# EAGLE design microbutton (EAGLE 7.5.0)
PRODUCT_COMPANY: skagmo.com, 2015; PRODUCT_TITLE: HAPCAN compatible DALI gateway, rev. A

## Sheet 1 of 2
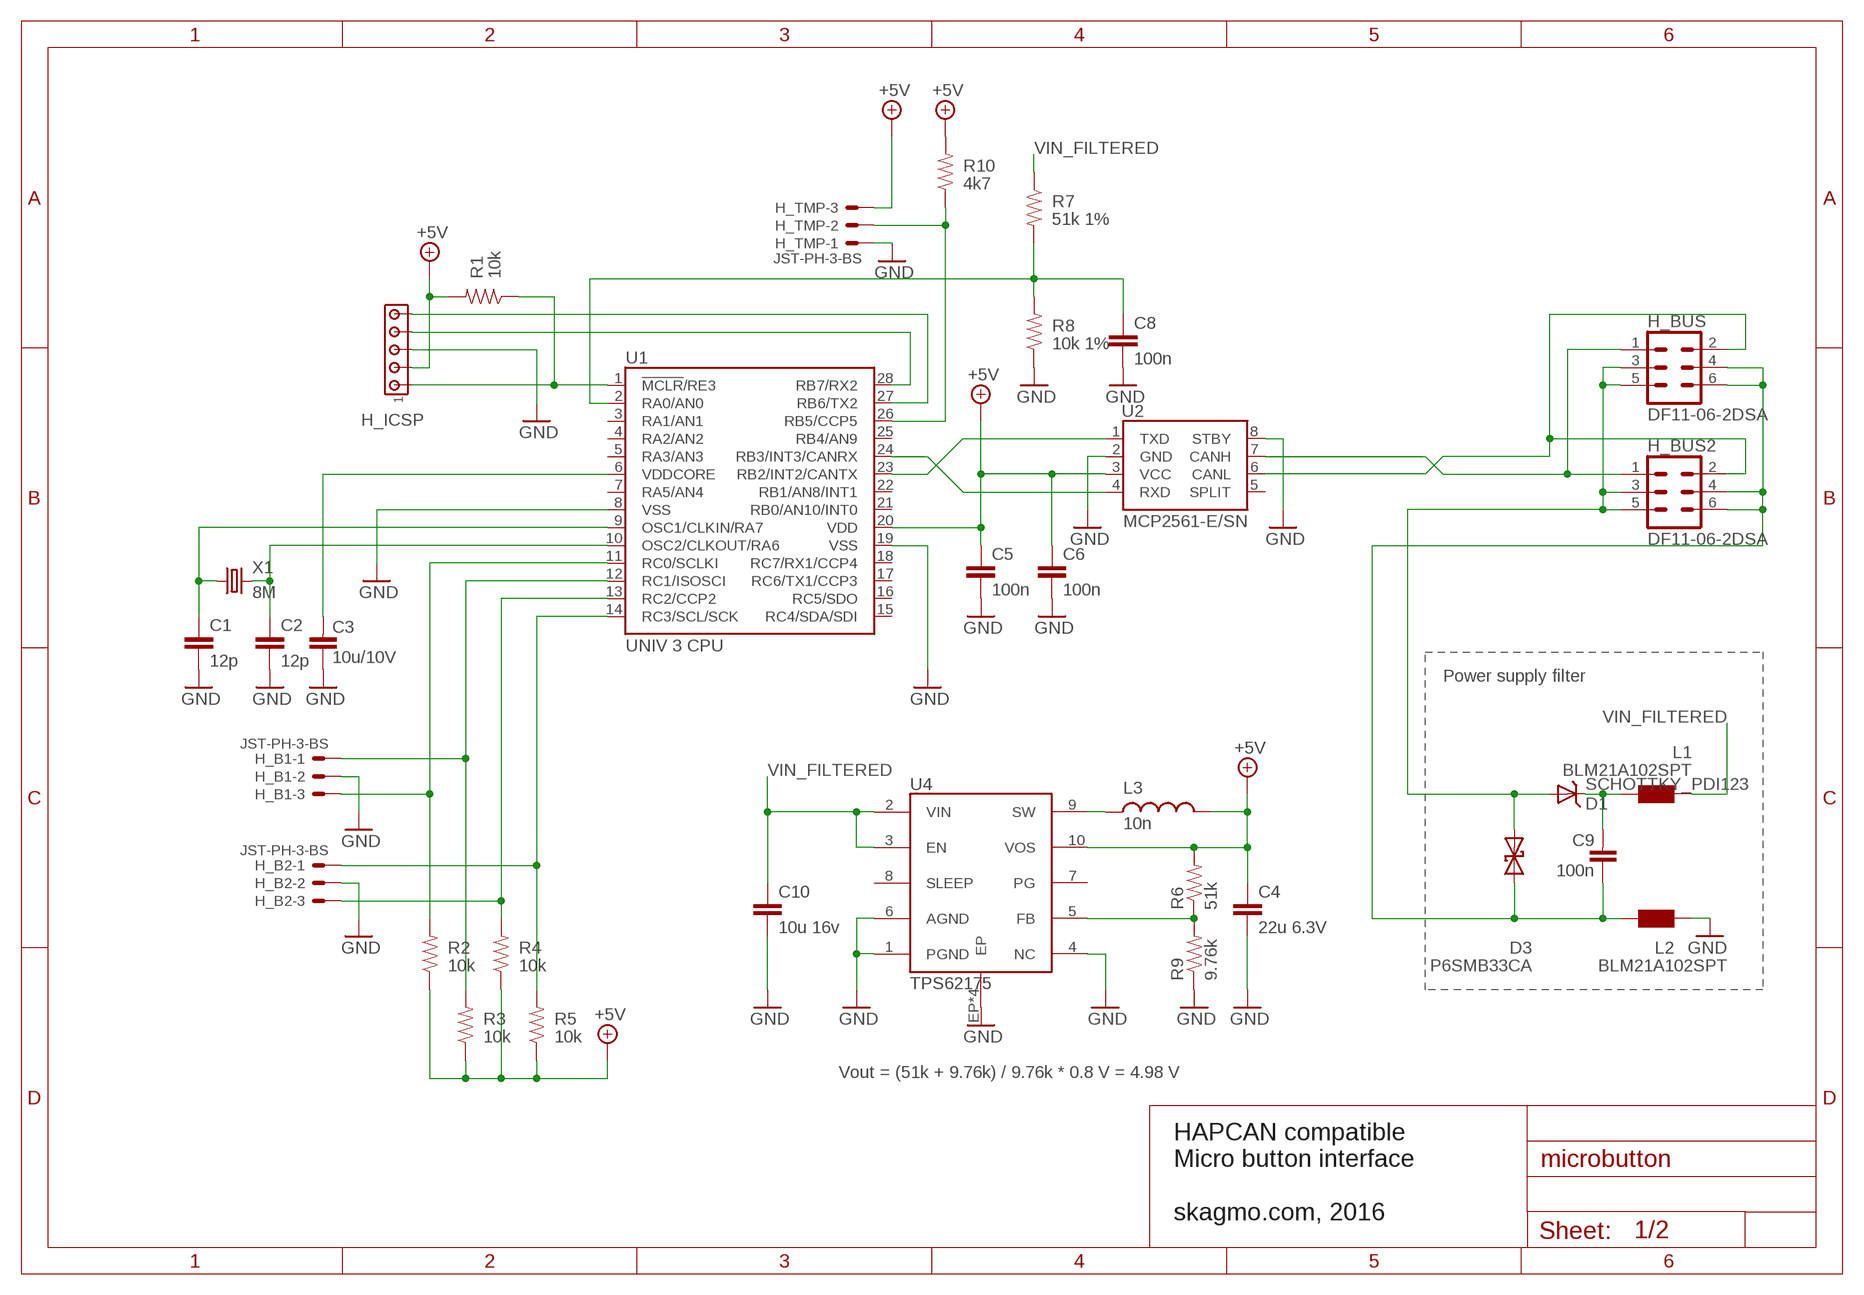
[diagram p0: schematic, sheet 1]

### Parts
C1  12p  CAP0603  [0603]
C2  12p  CAP0603  [0603]
C3  10u/10V  CAPACITOR0805  [0805]
C4  22u 6.3V  CAP0805  [0805]
C5  100n  CAP0603  [0603]
C6  100n  CAP0603  [0603]
C8  100n  CAP0603  [0603]
C9  100n  CAPACITOR0805  [0805]
C10  10u 16v  CAP1206  [1206]
D1  SCHOTTKY_PDI123  [POWERDI123]
D3  P6SMB33CA  DIODE_TRANSIL2  [DO-214_TRANSIL2]
H_B1  JST-PH-3-BS  [B3B-PH-K-S]
H_B2  JST-PH-3-BS  [B3B-PH-K-S]
H_BUS  DF11-06-2DSA  [DF11-06DP-2DSA]
H_BUS2  DF11-06-2DSA  [DF11-06DP-2DSA]
H_ICSP  HEADER5  [SIP-5]
H_TMP  JST-PH-3-BS  [B3B-PH-K-S]
L1  BLM21A102SPT  CHOKE0805  [0805]
L2  BLM21A102SPT  CHOKE0805  [0805]
L3  10n  INDUCTOR_SRN3015  [IND-SRN3015]
R1  10k  RESISTOR0603  [0603]
R2  10k  RESISTOR0603  [0603]
R3  10k  RESISTOR0603  [0603]
R4  10k  RESISTOR0603  [0603]
R5  10k  RESISTOR0603  [0603]
R6  51k  RESISTOR0603  [0603]
R7  51k 1%  RESISTOR0603  [0603]
R8  10k 1%  RESISTOR0603  [0603]
R9  9.76k  RESISTOR0603  [0603]
R10  4k7  RESISTOR0603  [0603]
U1  UNIV 3 CPU  UNIV3CPU  [UNIV3CPU]
U2  MCP2561-E/SN  [SO-08]
U4  TPS62175  [WSON-10]
X1  8M  CRYSTAL_HAND  [TXC-7A_HAND]

### Nets
+5V: C4.1 C5.1 C6.1 H_ICSP.2 H_TMP.3 L3.P$2 R1.2 R2.1 R3.1 R4.1 R5.1 R6.2 R10.2 U1.20(VDD) U2.3(VCC) U4.10(VOS)
CAN_N: H_BUS2.1 H_BUS.1 U2.7(CANH)
CAN_P: H_BUS2.2 H_BUS.2 U2.6(CANL)
GND: C1.2 C2.2 C3.2 C4.2 C5.2 C6.2 C8.2 C10.2 H_B1.2 H_B2.2 H_ICSP.3 H_TMP.1 L2.1 R8.1 R9.1 U1.8(VSS) U1.19(VSS) U2.2(GND) U2.8(STBY) U4.1(PGND) U4.4(NC) U4.6(AGND) U4.EP U4.V1(EP) U4.V2(EP) U4.V3(EP)
N$1: H_B1.3 R2.2 U1.11(RC0/SCLKI)
N$2: U1.24(RB3/INT3/CANRX) U2.4(RXD)
N$3: U1.23(RB2/INT2/CANTX) U2.1(TXD)
N$4: H_B1.1 R3.2 U1.12(RC1/ISOSCI)
N$5: C9.1 D1.C L1.2
N$6: H_B2.3 R4.2 U1.13(RC2/CCP2)
N$7: H_B2.1 R5.2 U1.14(RC3/SCL/SCK)
N$8: H_ICSP.1 R1.1 U1.1(!MCLR!/RE3)
N$9: D1.A D3.C H_BUS2.3 H_BUS2.5 H_BUS.3 H_BUS.5
N$10: H_ICSP.4 U1.28(RB7/RX2)
N$11: H_TMP.2 R10.1 U1.26(RB5/CCP5)
N$12: L3.P$1 U4.9(SW)
N$13: R6.1 R9.2 U4.5(FB)
N$14: H_ICSP.5 U1.27(RB6/TX2)
N$15: C2.1 U1.10(OSC2/CLKOUT/RA6) X1.2
N$16: C8.1 R7.2 R8.2 U1.2(RA0/AN0)
N$22: C9.2 D3.A H_BUS2.4 H_BUS2.6 H_BUS.4 H_BUS.6 L2.2
N$40: C1.1 U1.9(OSC1/CLKIN/RA7) X1.1
N$56: C3.1 U1.6(VDDCORE)
VIN_FILTERED: C10.1 L1.1 R7.1 U4.2(VIN) U4.3(EN)
Unconnected: U1.3(RA1/AN1) U1.4(RA2/AN2) U1.5(RA3/AN3) U1.7(RA5/AN4) U1.15(RC4/SDA/SDI) U1.16(RC5/SDO) U1.17(RC6/TX1/CCP3) U1.18(RC7/RX1/CCP4) U1.21(RB0/AN10/INT0) U1.22(RB1/AN8/INT1) U1.25(RB4/AN9) U2.5(SPLIT) U4.7(PG) U4.8(SLEEP)

### Notes on the sheet
- Power supply filter
- Vout = (51k + 9.76k) / 9.76k * 0.8 V = 4.98 V
- HAPCAN compatible
  Micro button interface
  
  skagmo.com, 2016

## Sheet 2 of 2

## Library data of the parts
C1 C2 C4-C6 C8 C10 = 01-eos-components:CAP: Capacitor Standard 0603 ceramic capacitor, and 0.1" leaded capacitor.
C3 C9 = HAPCAN_devices - UNIV3:CAPACITOR: HAPCAN Capacitor
D1 = 00-mr-library:SCHOTTKY
D3 = HAPCAN_devices - UNIV3-eagle5:DIODE_TRANSIL2: HAPCAN Bidirectional transil diode
H_B1 H_B2 H_TMP = 10-pcb_libraries_con-jst-ph:JST-PH-3
H_BUS H_BUS2 = con-hirose-df11:DF11-06-2DSA: HEADER
H_ICSP = HAPCAN_devices - UNIV3:HEADER5: HAPCAN Header 5
L1 L2 = HAPCAN_devices - UNIV3:CHOKE: Choke
L3 = 01-eos-components:INDUCTOR: Inductors Basic Inductor/Choke - 0603 and 1206. Footprints are not proven and vary greatly between part numbers.
R1-R10 = 01-eos-components:RESISTOR: Resistor Basic schematic elements and footprints for 0603, 1206, and PTH 1/10th watt (small) resistors.
U1 = HAPCAN_devices - UNIV3-eagle5:UNIV3CPU: HAPCAN Microcontroller UNIV 3 CPU
U2 = HAPCAN_devices - UNIV3:MCP2561: HAPCAN CAN Tranceiver
U4 = 03-vhf_sdr:TPS62175
X1 = 00-mr-library:CRYSTAL

## Board
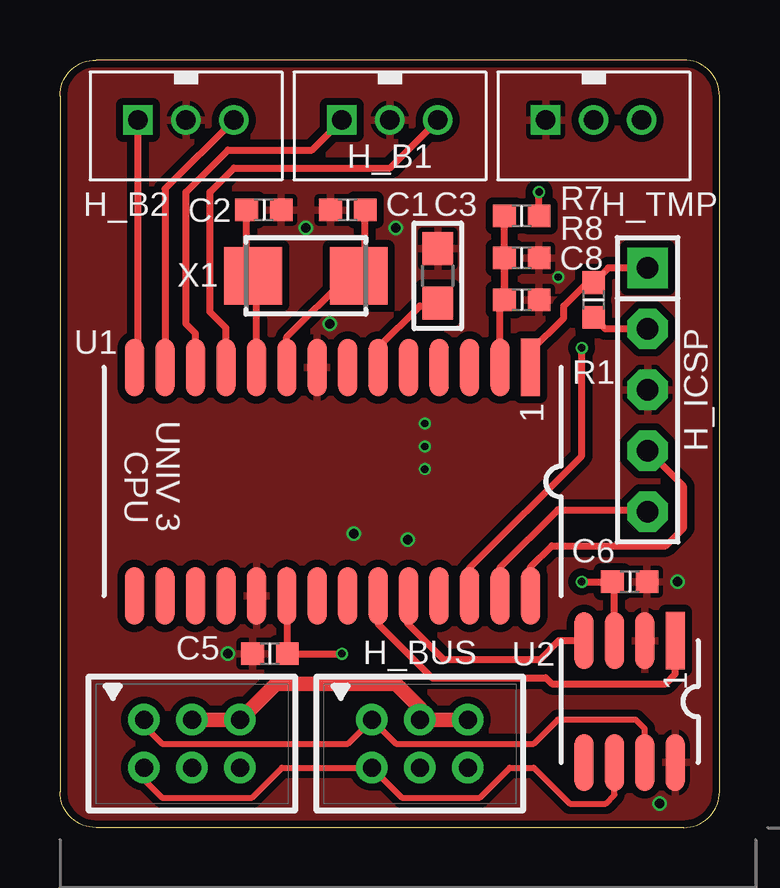
[diagram p1: board, top side]
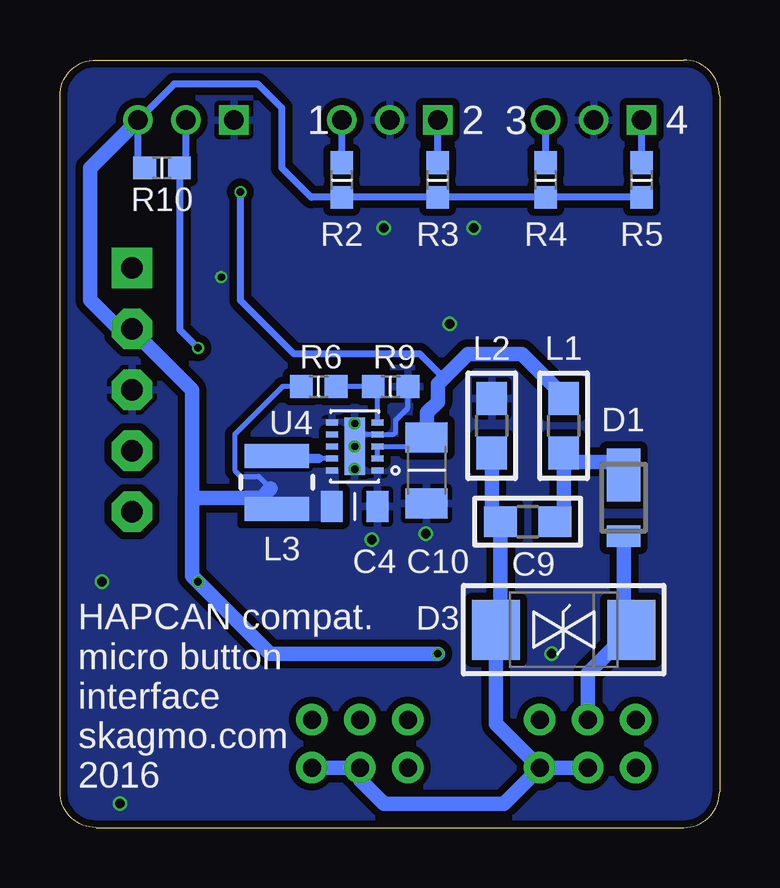
[diagram p2: board, bottom side, seen from below]

Size 27.5 x 32 mm. Coordinates in mm from the lower left corner, seen from the top.
Outline: 0,30.5 0,1.5 arc90 1.5,0 26,0 arc90 27.5,1.5 27.5,30.5 arc90 26,32 1.5,32 arc90 0,30.5
Copper layers (1+2*15+16): Top 0.035mm / dielectric 0.2mm / Route2 0.035mm / dielectric 1mm / Route15 0.035mm / dielectric 0.2mm / Bottom 0.035mm
Design rules "mr_drc": minimum track width 0.15mm, minimum drill 0.3mm, track to track 0.15mm, track to pad 0.15mm, pad to pad 0.15mm, via to via 0.15mm, smd to smd 0.05mm, copper to edge 0.3mm, drill to drill 0.4mm, minimum pad ring 0.1mm, minimum via ring 0.1mm, stop-mask expansion 0.05mm, vias tented up to drill 0.8mm, thermal gap 0.2mm

### Footprints (pad centres in the part's own frame; a part is rotated, then mirrored left to right if it is on the bottom)
0603 = smd 0.95 x 0.95: 1 -0.725,0; 2 0.725,0
0805 = smd 1.372 x 1.27: 1 -1.143,0; 2 1.143,0
0805' = smd 0.9 x 1.3: 1 -0.95,0; 2 0.95,0
1206 = smd 1.25 x 1.75: 1 -1.375,0; 2 1.375,0
POWERDI123 = smd 0.9 x 1.4: A 1.6,0 | smd 2.2 x 1.4: C -0.95,0
DO-214_TRANSIL2 = smd 2 x 2.5: A 2.82,0; C -2.82,0
B3B-PH-K-S = drill 0.813 square: 1 2,0 | drill 0.813: 2 0,0; 3 -2,0
DF11-06DP-2DSA = drill 0.75 pad 1.3: 1 2,-1; 2 2,1; 3 0,-1; 4 0,1; 5 -2,-1; 6 -2,1
SIP-5 = drill 0.9 pad 1.676 square: 1 -5.08,0 | drill 0.9 pad 1.676 octagon: 2 -2.54,0; 3 0,0; 4 2.54,0; 5 5.08,0
IND-SRN3015 = smd 2.7 x 1: P$1 0,1.1; P$2 0,-1.1
UNIV3CPU = smd 2.4 x 0.8: 1 -4.763,8.255; 2 -4.763,6.985; 3 -4.763,5.715; 4 -4.763,4.445; 5 -4.763,3.175; 6 -4.763,1.905; 7 -4.763,0.635; 8 -4.763,-0.635; 9 -4.763,-1.905; 10 -4.763,-3.175; 11 -4.763,-4.445; 12 -4.763,-5.715; 13 -4.763,-6.985; 14 -4.763,-8.255; 15 4.763,-8.255; 16 4.763,-6.985; 17 4.763,-5.715; 18 4.763,-4.445; 19 4.763,-3.175; 20 4.763,-1.905; 21 4.763,-0.635; 22 4.763,0.635; 23 4.763,1.905; 24 4.763,3.175; 25 4.763,4.445; 26 4.763,5.715; 27 4.763,6.985; 28 4.763,8.255
SO-08 = smd 2.4 x 0.8: 1 -2.54,1.905; 2 -2.54,0.635; 3 -2.54,-0.635; 4 -2.54,-1.905; 5 2.54,-1.905; 6 2.54,-0.635; 7 2.54,0.635; 8 2.54,1.905
WSON-10 = smd 0.5 x 0.25: 1 -0.95,1; 2 -0.95,0.5; 3 -0.95,0; 4 -0.95,-0.5; 5 -0.95,-1; 6 0.95,-1; 7 0.95,-0.5; 8 0.95,0; 9 0.95,0.5; 10 0.95,1 | smd 0.84 x 2.4: EP 0,0 | drill 0.3 pad 0.406: V1 0,0.95; V2 0,0; V3 0,-0.95
TXC-7A_HAND = smd 2.4 x 2.4: 1 -2.2,0; 2 2.2,0

### Placement (x,y rotation side)
C1  12,25.75 180 top
C2  8.5,25.75 0 top
C3  15.75,23 90 top
C4  22u 6.3V  [0805']  15.21,13.39 0 bottom
C5  8.75,7.25 180 top
C6  23.75,10.25 0 top
C8  19.25,22 0 top
C9  8,12.75 180 bottom
C10  12.21,14.89 270 bottom
D1  4,13.75 270 bottom
D3  6.5,8.25 180 bottom
H_B1  13.75,29.5 180 top
H_B2  5.25,29.5 180 top
H_BUS  15,3.5 180 top
H_BUS2  5.5,3.5 180 top
H_ICSP  24.5,18.25 270 top
H_TMP  22.25,29.5 180 top
L1  6.5,16.75 270 bottom
L2  9.5,16.75 270 bottom
L3  18.46,14.39 0 bottom
R1  22.25,22 270 top
R2  15.75,27 90 bottom
R3  11.75,27 90 bottom
R4  7.25,27 90 bottom
R5  3.25,27 90 bottom
R6  16.71,18.39 180 bottom
R7  19.25,25.5 180 top
R8  19.25,23.75 180 top
R9  13.71,18.39 180 bottom
R10  23.25,27.5 180 bottom
U1  11.36,14.42 270 top
U2  23.75,5.25 270 top
U4  15.21,15.89 180 bottom
X1  10.25,23 180 top

### Tracks (layer width: path | path; a pad name or v marks a point on that pad's centre or on a via)
+5V  (via drill 0.3)
  Top 0.3: H_ICSP.2 22.73,20.79 R1.2 | U1.20 9.47,9.64 C5.1 v11.75,7.25 | v21.75,10.25 C6.1 23.11,10.16 U2.3
  Bottom 0.2: R6.2 18.21,18.39 20.21,16.39 20.21,14.89 19.96,14.64 19.21,14.64 18.71,14.14
  Bottom 0.3: R5.1 R4.1 R3.1 R2.1 17.02,26.27 18.25,27.5 18.25,30 19.25,31 22.75,31 H_TMP.3 24.25,27.77 R10.2
  Bottom 0.6: 22,13.75 22,18.25 24.25,20.5 H_ICSP.2 24.54,20.75 25,20.75 26.25,22 26.25,27.5 H_TMP.3 | 22,13.75 19.1,13.75 18.71,14.14 | v11.75,7.25 18.75,7.25 v21.75,10.25 22,10.5 22,13.75
  pour Bottom (no thermals): 19.71,14.89 19.71,12.89 15.96,12.89 15.96,14.89
CAN_N
  Top 0.25: U2.7 24.39,4.12 24,4.5 20.75,4.5 19.75,3.5 14,3.5 H_BUS.1 12,3.5 4.25,3.5 3.5,4.25 H_BUS2.1
CAN_P
  Top 0.25: H_BUS2.2 3.5,2 4.25,1.25 8,1.25 9.25,2.5 H_BUS.2 14.25,1.25 17.5,1.25 18.75,2.5 19.75,2.5 21.25,1 22.75,1 23.11,1.36 U2.6
GND  (via drill 0.3, 0.4)
  Bottom 0.2: U4.EP 15.21,16.39 U4.4 13.61,16.39 13.5,16.5 13.5,17 13,17.5 13,18.25
  other vias: 25,1 25.75,10.25 7,7.25 10.25,25 14,25 12.25,12.25 14.5,12 11.25,21 20.77,22.95
  pour Top (isolate 0.305): 28,-0.5 -0.5,-1.5 -1,33 28,32.5
  pour Bottom (isolate 0.305, rank 2): 30,-1 -1,-2 -0.5,36.5 30,37
N$1
  Top 0.3: U1.11 6.92,20.83 6.25,21.5 6.25,26.5 7.25,27.5 13.75,27.5 H_B1.3
  Bottom 0.3: R2.2 H_B1.3
N$2
  Top 0.3: U2.4 20.79,7.79 20,7 16,7 14.5,8.5 14.5,9.37 U1.24
N$3
  Top 0.3: U1.23 13.27,8.48 15.5,6.25 20.25,6.25 20.5,6 25.25,6 25.66,6.41 U2.1
N$4
  Top 0.3: U1.12 5.65,20.6 5.25,21 5.25,26.5 7,28.25 10.5,28.25 H_B1.1
  Bottom 0.3: R3.2 H_B1.1
N$5
  Bottom 0.6: C9.1 6.5,13.11 L1.2 6.36,15.61 6,15.25 4.55,15.25 D1.C
N$6
  Top 0.3: H_B2.3 4.38,26.63 U1.13
  Bottom 0.3: R4.2 H_B2.3
N$7
  Top 0.3: U1.14 3.11,19.14 3.25,19.25 H_B2.1
  Bottom 0.3: R5.2 H_B2.1
N$8
  Top 0.3: H_ICSP.1 22.86,23.33 R1.1 22.02,22.5 22,22.75 21,21.75 21,21.25 19.62,19.87 U1.1
N$9
  Top 0.6: H_BUS2.3 H_BUS2.5 9,6 14,6 15,5 H_BUS.3 H_BUS.5
  Bottom 0.6: D1.A 4,8.75 D3.C 5.5,6.43 H_BUS2.3
N$10
  Top 0.3: H_ICSP.4 26,14.21 26,12.5 25.25,11.75 20.5,11.75 19.62,10.87 U1.28
N$11  (via drill 0.3)
  Top 0.3: U1.26 17.08,10.83 21.75,15.5 v21.75,20
  Bottom 0.3: H_TMP.2 22.25,27.77 R10.1 22.5,27.48 22.5,20.75 v21.75,20
N$12
  Bottom 0.2: U4.9 16.71,15.39
  Bottom 0.4: 16.71,15.39 18.36,15.39 L3.P$1
N$13
  Bottom 0.2: U4.5 14.26,18.21 R9.2 R6.1
N$14
  Top 0.3: U1.27 18.35,10.85 20.75,13.25 24.33,13.25 H_ICSP.5
N$15
  Top 0.3: U1.10 8.19,23.11 X1.2 7.78,23.27 C2.1
N$16
  Top 0.3: C8.1 R7.2 | R8.2 C8.1 | U1.2 18.35,21.82 C8.1
N$22
  Bottom 0.6: H_BUS.6 H_BUS.4 15,2 14,1 9,1 H_BUS2.6 | H_BUS2.4 H_BUS2.6 | L2.2 9.5,13.11 C9.2 9.14,8.75 D3.A 9.32,4.32 H_BUS2.6
N$40
  Top 0.3: U1.9 9.46,20.46 12,23 X1.1 12.72,23.27 C1.1
N$56
  Top 0.3: U1.6 13.27,20.02 15,21.75 15.64,21.75 C3.1
VIN_FILTERED  (via drill 0.3)
  Top 0.3: R7.1 v19.98,26.5
  Bottom 0.2: U4.2 U4.3 12.76,15.89 C10.1
  Bottom 0.3: 11.5,18.75 12.5,19.75 17.75,19.75 19.98,21.98 v19.98,26.5
  Bottom 0.6: L1.1 6.6,17.99 6.6,18.1 8.25,19.75 10.5,19.75 11.5,18.75 11.75,18.5 11.75,17.75 12.2,17.3 12.2,16.5 C10.1

### Text on the board
bPlace: HAPCAN compat. / micro button / interface / skagmo.com / 2016
bNames: 4 | 3 | 2 | 1